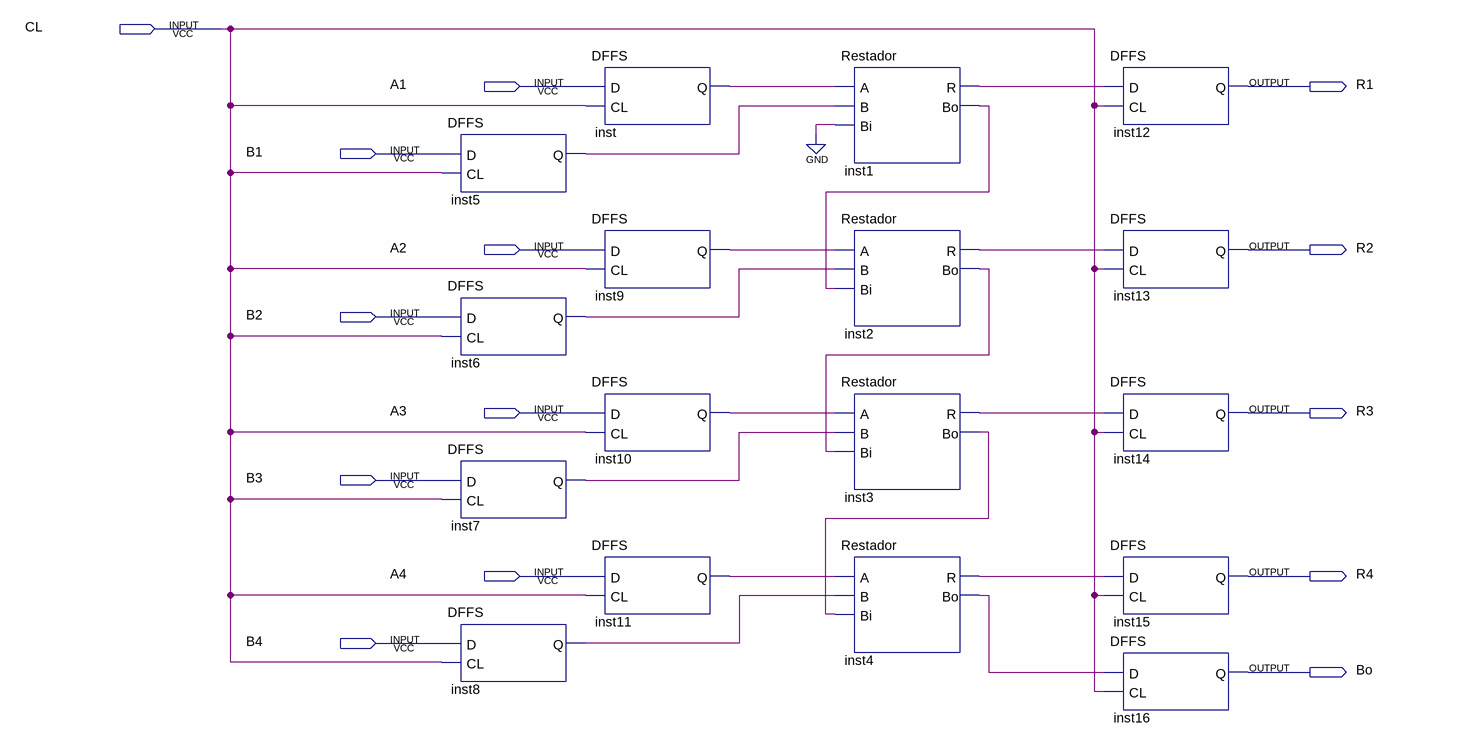
[diagram p0: schematic sheet]
// Quartus schematic ParteCblock.bdf as structural Verilog: 17 symbols, 14 pins
module ParteCblock (
  input  CL,
  input  A1,
  input  B1,
  input  A2,
  input  B2,
  input  A3,
  input  B3,
  input  A4,
  input  B4,
  output R1,
  output R2,
  output R3,
  output R4,
  output Bo
);

  wire inst1_bo, inst1_r, inst2_bo, inst2_r, inst3_bo, inst3_r, inst4_bo, inst4_r, inst5_q, inst6_q, inst7_q,
       inst8_q, inst9_q, inst10_q, inst11_q, inst_q;

  DFFS inst5 (.D(B1), .CL(CL), .Q(inst5_q));
  DFFS inst6 (.D(B2), .CL(CL), .Q(inst6_q));
  DFFS inst7 (.D(B3), .CL(CL), .Q(inst7_q));
  DFFS inst8 (.D(B4), .CL(CL), .Q(inst8_q));
  DFFS inst (.D(A1), .CL(CL), .Q(inst_q));
  DFFS inst9 (.D(A2), .CL(CL), .Q(inst9_q));
  DFFS inst10 (.D(A3), .CL(CL), .Q(inst10_q));
  DFFS inst11 (.D(A4), .CL(CL), .Q(inst11_q));
  Restador inst1 (.A(inst_q), .B(inst5_q), .Bi(1'b0), .R(inst1_r), .Bo(inst1_bo));
  Restador inst2 (.A(inst9_q), .B(inst6_q), .Bi(inst1_bo), .R(inst2_r), .Bo(inst2_bo));
  Restador inst3 (.A(inst10_q), .B(inst7_q), .Bi(inst2_bo), .R(inst3_r), .Bo(inst3_bo));
  Restador inst4 (.A(inst11_q), .B(inst8_q), .Bi(inst3_bo), .R(inst4_r), .Bo(inst4_bo));
  DFFS inst12 (.D(inst1_r), .CL(CL), .Q(R1));
  DFFS inst13 (.D(inst2_r), .CL(CL), .Q(R2));
  DFFS inst14 (.D(inst3_r), .CL(CL), .Q(R3));
  DFFS inst15 (.D(inst4_r), .CL(CL), .Q(R4));
  DFFS inst16 (.D(inst4_bo), .CL(CL), .Q(Bo));
endmodule
